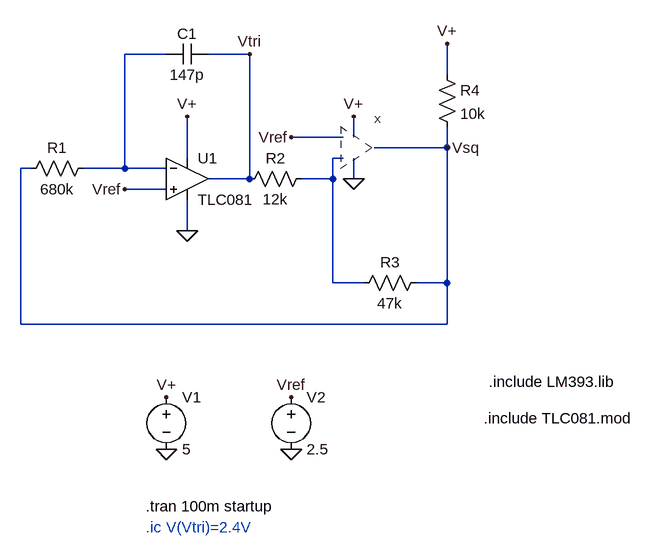
[diagram p0: schematic Transmitter.asc]
Transmitter.asc, the LTspice schematic file:
Version 4
SHEET 1 1508 728
WIRE -16 -112 -80 -112
WIRE 112 -112 48 -112
WIRE 416 -80 416 -128
WIRE 256 16 176 16
WIRE 272 16 272 -16
WIRE 416 32 416 0
WIRE 416 32 304 32
WIRE 16 48 16 -16
WIRE 256 48 240 48
WIRE -224 64 -240 64
WIRE -80 64 -80 -112
WIRE -80 64 -144 64
WIRE -16 64 -80 64
WIRE 112 80 112 -112
WIRE 112 80 48 80
WIRE 240 80 240 48
WIRE 240 80 192 80
WIRE 272 80 272 48
WIRE -16 96 -80 96
WIRE 16 160 16 112
WIRE 240 240 240 80
WIRE 288 240 240 240
WIRE 416 240 416 32
WIRE 416 240 368 240
WIRE -240 304 -240 64
WIRE 416 304 416 240
WIRE 416 304 -240 304
FLAG 16 -16 V+
FLAG -16 496 0
FLAG -16 416 V+
FLAG 112 -112 Vtri
FLAG 16 160 0
FLAG 176 496 0
FLAG 176 416 Vref
FLAG -80 96 Vref
FLAG 176 16 Vref
FLAG 272 80 0
FLAG 272 -16 V+
FLAG 416 32 Vsq
FLAG 416 -128 V+
SYMBOL res -128 48 R90
WINDOW 0 0 56 VBottom 2
WINDOW 3 32 56 VTop 2
SYMATTR InstName R1
SYMATTR Value 680k
SYMBOL cap -16 -96 R270
WINDOW 0 32 32 VTop 2
WINDOW 3 0 32 VBottom 2
SYMATTR InstName C1
SYMATTR Value 147p
SYMBOL res 208 64 R90
WINDOW 0 0 56 VBottom 2
WINDOW 3 32 56 VTop 2
SYMATTR InstName R2
SYMATTR Value 12k
SYMBOL res 384 224 R90
WINDOW 0 0 56 VBottom 2
WINDOW 3 32 56 VTop 2
SYMATTR InstName R3
SYMATTR Value 47k
SYMBOL voltage -16 400 R0
SYMATTR InstName V1
SYMATTR Value 5
SYMBOL voltage 176 400 R0
WINDOW 123 0 0 Left 0
WINDOW 39 0 0 Left 0
SYMATTR InstName V2
SYMATTR Value 2.5
SYMBOL opamp2 16 16 R0
SYMATTR InstName U1
SYMATTR Value TLC081
SYMBOL Res 400 -96 R0
SYMATTR InstName R4
SYMATTR Value 10k
SYMBOL LM2903B_custom 272 32 R0
SYMATTR InstName X
SYMATTR Value LM2903B
TEXT -48 584 Left 2 !.tran 100m startup
TEXT -48 616 Left 2 ;.ic V(Vtri)=2.4V
TEXT 472 448 Left 2 !.include TLC081.mod
TEXT 480 392 Left 2 !.include LM393.lib

The netlist it stands for:
* Transmitter.asc
R1 N001 Vsq 680k
C1 N001 Vtri 147p
R2 N002 Vtri 12k
R3 Vsq N002 47k
V1 V+ 0 5
V2 Vref 0 2.5
XU1 Vref N001 V+ 0 Vtri TLC081  ; pins In+ In- V+ V- OUT
R4 V+ Vsq 10k
XX Vref N002 V+ 0 Vsq LM2903B_custom params: LM2903B  ; pins IN+ IN- VCC GND OUT
.tran 100m startup
* .ic V(Vtri)=2.4V
.include TLC081.mod
.include LM393.lib
.backanno
.end